# Altium project 4KW Power Factor Correction.PrjPcb
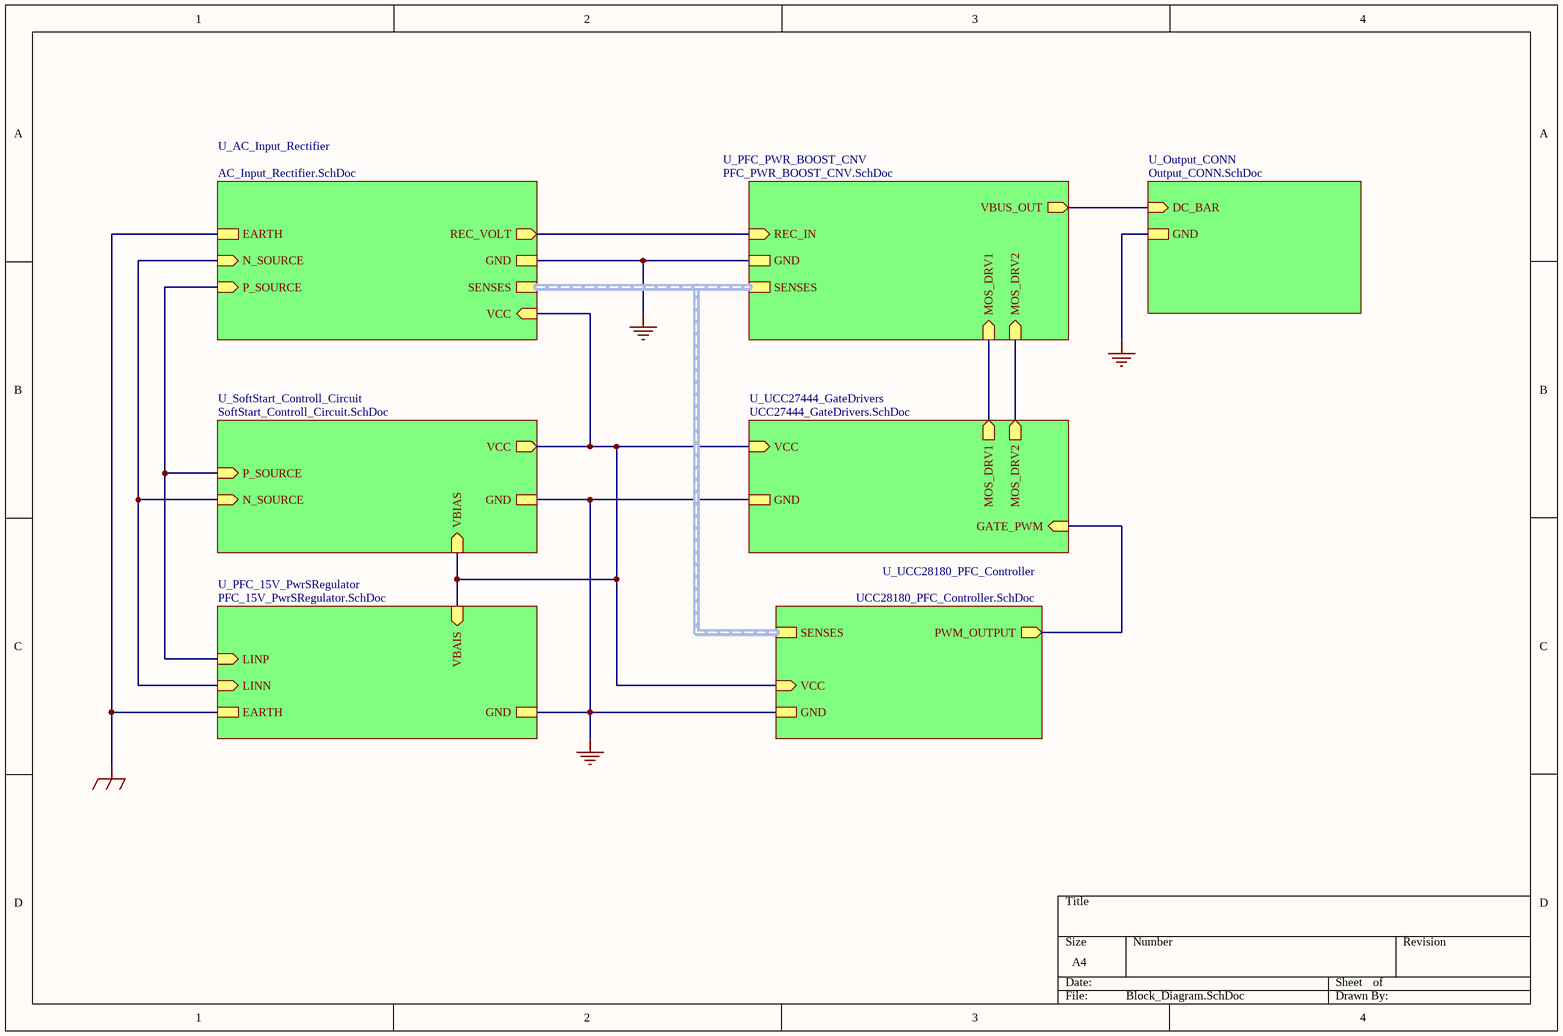
[diagram p0: Block_Diagram.SchDoc]
8 sheets, 98 parts. Net scope: hierarchical (ports join the sheet entries above them; power ports are global).
Board file: 1K5_Power_Factor_V0.PcbDoc
Sheets:
  Block_Diagram.SchDoc
    U_AC_Input_Rectifier = AC_Input_Rectifier.SchDoc
    U_PFC_PWR_BOOST_CNV = PFC_PWR_BOOST_CNV.SchDoc
    U_UCC27444_GateDrivers = UCC27444_GateDrivers.SchDoc
    U_UCC28180_PFC_Controller = UCC28180_PFC_Controller.SchDoc
    U_SoftStart_Controll_Circuit = SoftStart_Controll_Circuit.SchDoc
    U_Output_CONN = Output_CONN.SchDoc
    U_PFC_15V_PwrSRegulator = PFC_15V_PwrSRegulator.SchDoc

## Sheet Block_Diagram.SchDoc
size A4; SheetNumber: 1; SheetTotal: 8

### Sub-sheets
U_AC_Input_Rectifier = AC_Input_Rectifier.SchDoc: REC_VOLT (out), VCC (in), P_SOURCE (in), N_SOURCE (in), GND, SENSES (harness SENSES), EARTH
U_Output_CONN = Output_CONN.SchDoc: DC_BAR (in), GND
U_PFC_15V_PwrSRegulator = PFC_15V_PwrSRegulator.SchDoc: LINP (in), LINN (in), VBAIS (in), GND, EARTH
U_PFC_PWR_BOOST_CNV = PFC_PWR_BOOST_CNV.SchDoc: VBUS_OUT (out), GND, MOS_DRV1 (in), MOS_DRV2 (in), REC_IN (in), SENSES (harness SENSES)
U_SoftStart_Controll_Circuit = SoftStart_Controll_Circuit.SchDoc: GND, P_SOURCE (in), N_SOURCE (in), VBIAS (in), VCC (out)
U_UCC27444_GateDrivers = UCC27444_GateDrivers.SchDoc: MOS_DRV1 (out), MOS_DRV2 (out), VCC (in), GND, GATE_PWM (in)
U_UCC28180_PFC_Controller = UCC28180_PFC_Controller.SchDoc: VCC (in), GND, SENSES (harness SENSES), PWM_OUTPUT (out)

### Nets
15V: sheet U_AC_Input_Rectifier/VCC, sheet U_UCC27444_GateDrivers/VCC, sheet U_UCC28180_PFC_Controller/VCC, sheet U_SoftStart_Controll_Circuit/VBIAS, sheet U_SoftStart_Controll_Circuit/VCC, sheet U_PFC_15V_PwrSRegulator/VBAIS
EARTH: sheet U_AC_Input_Rectifier/EARTH, sheet U_PFC_15V_PwrSRegulator/EARTH
GND: sheet U_AC_Input_Rectifier/GND, sheet U_PFC_PWR_BOOST_CNV/GND, sheet U_UCC27444_GateDrivers/GND, sheet U_UCC28180_PFC_Controller/GND, sheet U_SoftStart_Controll_Circuit/GND, sheet U_Output_CONN/GND, sheet U_PFC_15V_PwrSRegulator/GND
VBUS: sheet U_PFC_PWR_BOOST_CNV/VBUS_OUT, sheet U_Output_CONN/DC_BAR
NetC1_2: sheet U_AC_Input_Rectifier/REC_VOLT, sheet U_PFC_PWR_BOOST_CNV/REC_IN
NetD1_2: sheet U_AC_Input_Rectifier/P_SOURCE, sheet U_SoftStart_Controll_Circuit/P_SOURCE, sheet U_PFC_15V_PwrSRegulator/LINP
NetD1_3: sheet U_AC_Input_Rectifier/N_SOURCE, sheet U_SoftStart_Controll_Circuit/N_SOURCE, sheet U_PFC_15V_PwrSRegulator/LINN
NetD6_1: sheet U_PFC_PWR_BOOST_CNV/MOS_DRV1, sheet U_UCC27444_GateDrivers/MOS_DRV1
NetR9_2: sheet U_UCC27444_GateDrivers/GATE_PWM, sheet U_UCC28180_PFC_Controller/PWM_OUTPUT
(unnamed): sheet U_PFC_PWR_BOOST_CNV/MOS_DRV2, sheet U_UCC27444_GateDrivers/MOS_DRV2

### Buses and harness runs
harness sheet U_AC_Input_Rectifier/SENSES = sheet U_PFC_PWR_BOOST_CNV/SENSES = sheet U_UCC28180_PFC_Controller/SENSES

## Sheet AC_Input_Rectifier.SchDoc
size A4; SheetNumber: 2; SheetTotal: 8
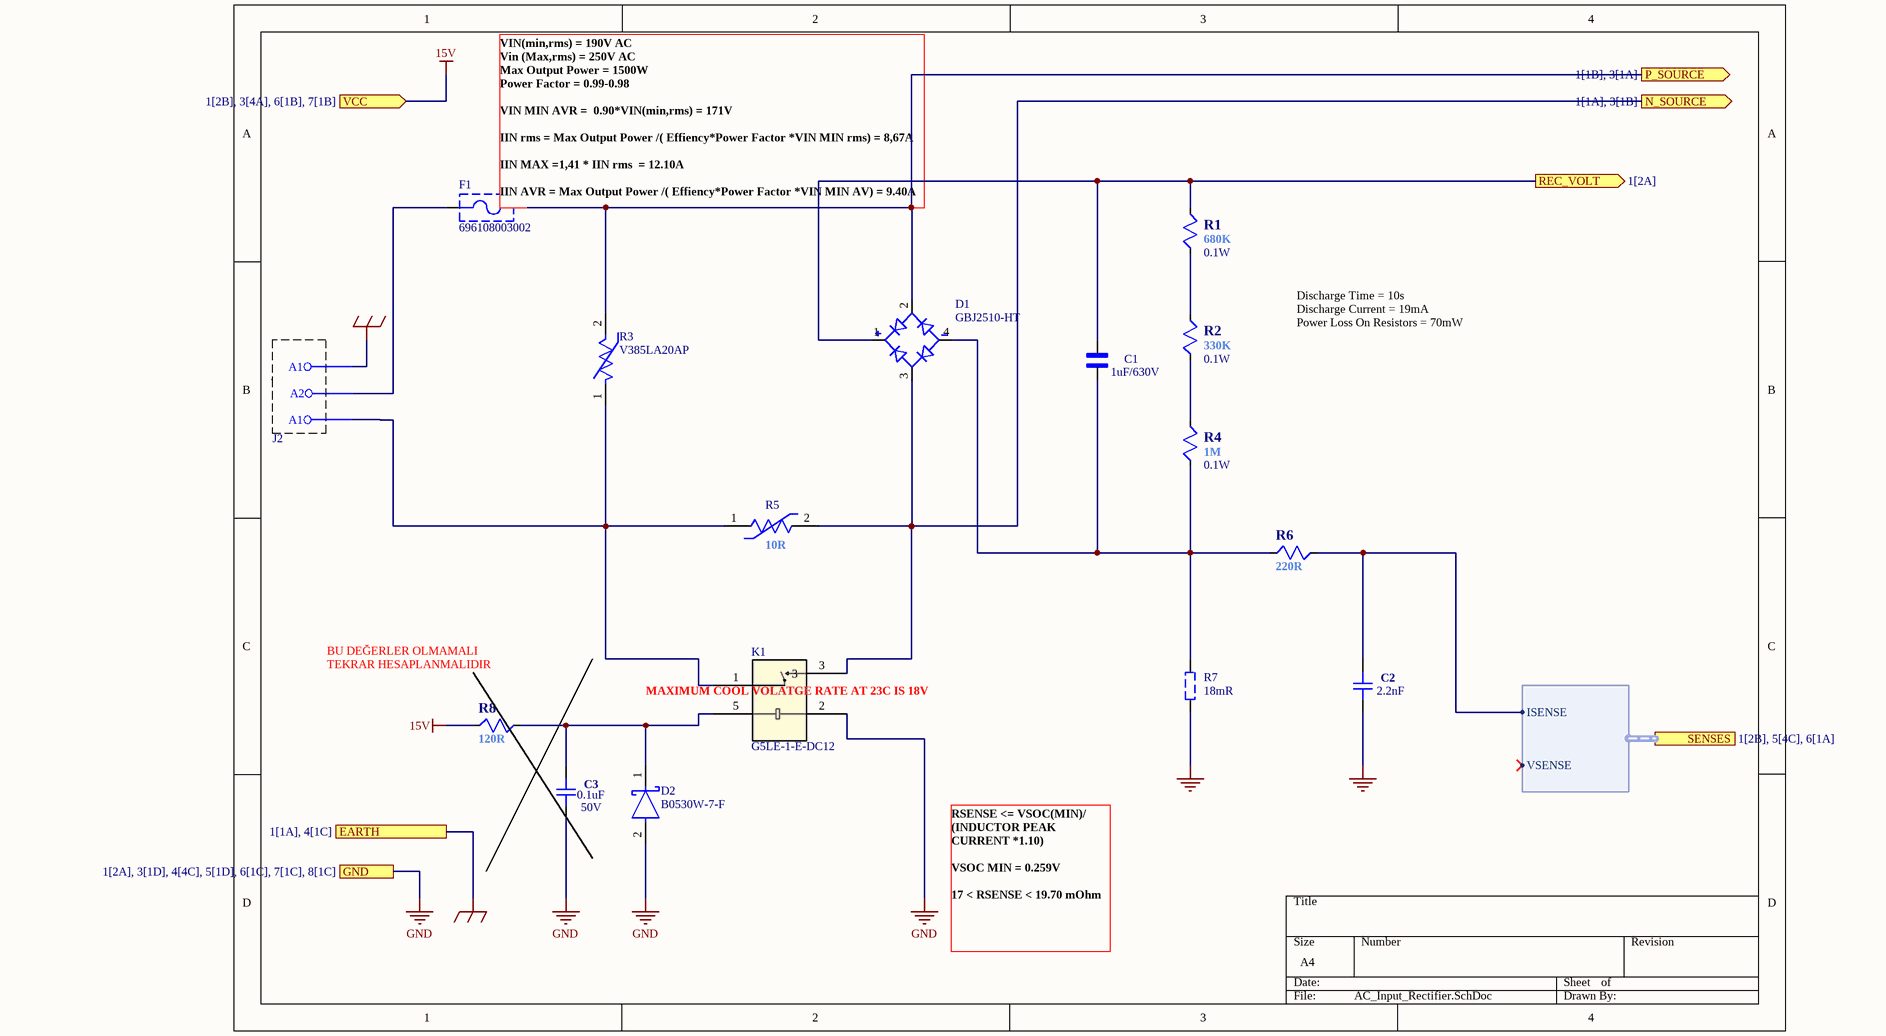
[diagram p1: AC_Input_Rectifier.SchDoc]

### Parts
C1  value 1uF/630V  [CAPRR3750W100L4150T1800H3250]  (hidden comment: B32026A3105M000)
C2  value 2.2nF  [CAPC1608N]  (hidden comment: CL10B222KB8NNNC)
C3  value 0.1uF  Rating: 50V  [CAPC1608N]  (hidden comment: CL10B104KB8NNNC)
D1  GBJ2510-HT  [DIOB_GBJ2510-F]
D2  B0530W-7-F  [FP-SOD123-MFG]
F1  696108003002  [696108003002]
J2  DG25S-B-03P-13-00AH  [DG28C-B-03P]  (value not drawn)
K1  G5LE-1-E-DC12  [G5LE-1-E-DC12]
R1  value 680K  Power Dissipation: 0.1W  [RESC1608N]  (hidden comment: CRT03F7E6803)
R2  value 330K  Power Dissipation: 0.1W  [RESC1608N]  (hidden comment: RC0603JR-07330KL)
R3  V385LA20AP  [FP-B72214S0301K101-0]
R4  value 1M  Power Dissipation: 0.1W  [RESC1608N]  (hidden comment: RI0603L105JT)
R5  Resistance: 10R  [FP-PGTL_P5_D7_4_T4_H13_4-MFG]  (hidden comment: PPL19100HA1B7CKB)
R6  value 220R  [RESC1608N]  (hidden comment: 0603SAF2200T5E)
R7  value 18mR  [CSS2H-2512]  (hidden comment: PE2512FKE7W0R018L)
R8  value 120R  [RESC1608N]  (hidden comment: CRT03J7E1200)

### Ports
EARTH (see 1[1A], 4[1C]), GND (see 1[2A], 3[1D], 4[4C], 5[1D], 6[1C], 7[1C], 8[1C]), N_SOURCE (out, see 1[1A], 3[1B]), P_SOURCE (out, see 1[1B], 3[1A]), REC_VOLT (out, see 1[2A]), SENSES (harness SENSES, see 1[2B], 5[4C], 6[1A]), VCC (in, see 1[2B], 3[4A], 6[1B], 7[1B])

### Harnesses
SENSES: ISENSE, VSENSE

### Nets
15V: R8.1 ; port VCC
EARTH: J2.3(A1) ; port EARTH
GND: C2.1 C3.1 D2.2(A) K1.2 R7.1 ; port GND
ISENSE: C2.2 R6.2 ; port SENSES.ISENSE
NetC1_1: C1.1 D1.4(NEG) R4.2 R6.1 R7.2
NetC1_2: C1.2 D1.1(POS) R1.1 ; port REC_VOLT
NetC3_2: C3.2 D2.1(C) K1.5 R8.2
NetD1_2: D1.2(AC1) F1.2 R3.2 ; port P_SOURCE
NetD1_3: D1.3(AC2) K1.3 R5.2 ; port N_SOURCE
NetF1_1: F1.1 J2.2(A2)
NetJ2_1: J2.1(A1) K1.1 R3.1 R5.1
NetR1_2: R1.2 R2.1
NetR2_2: R2.2 R4.1

### Notes on the sheet
- (near F1) VIN(min,rms) = 190V AC
  Vin (Max,rms) = 250V AC
  Max Output Power = 1500W
  Power Factor = 0.99-0.98
  VIN MIN AVR =  0.90*VIN(min,rms) = 171V
  IIN rms = Max Output Power /( Effiency*Power Factor *VIN MIN rms) = 8,67A
  IIN MAX =1,41 * IIN rms  = 12.10A
  IIN AVR = Max Output Power /( Effiency*Power Factor *VIN MIN AV) = 9.40A
- Discharge Time = 10s
  Discharge Current = 19mA
  Power Loss On Resistors = 70mW
- BU DEĞERLER OLMAMALI
- TEKRAR HESAPLANMALIDIR
- (near K1) MAXIMUM COOL VOLATGE RATE AT 23C IS 18V
- RSENSE <= VSOC(MIN)/ (INDUCTOR PEAK CURRENT *1.10)
  VSOC MIN = 0.259V
  17 < RSENSE < 19.70 mOhm

### Library data of the parts
C1 = B32026A3105M000: CAP, 1ÂµF, 20%, PP; Capacitance: 1ÂµF; Suppression Class: Y2; Product Range: B32026 Series; Voltage Rating X: -; Voltage Rating Y: 300V; Capacitor Dielectric Type: PP (Polypropylene); Capacitance Tolerance: Â± 20%; dv/dt Rating: 30; MF: TDK Electronics; SnapEDA_Link: https://www.snapeda.com/parts/B32026A3105M000/TDK/view-part/?ref=snap; Package: None; MP: B32026A3105M000; Check_prices: https://www.snapeda.com/parts/B32026A3105M000/TDK/view-part/?ref=eda
C2 = CAP_0805: MLCC (1608) 0603 2.2nF 50VDC ±10% X7R; Rating: 50V; Manufacturer: *; Manufacturer Part Number: *; Distributor Link: *; LCSC: *
C3 = CAP_0805: MLCC (1608) 0603 100nF 50VDC ±10% X7R; Manufacturer: *; Manufacturer Part Number: *; Distributor Link: *; LCSC: *
D1 = GBJ2510-HT: DIODE BRIDGE 25A 1000V; MF: Micro Commercial; MP: GBJ3510-BP; SnapEDA_Link: https://www.snapeda.com/parts/GBJ3510-BP/Micro%20Commercial/view-part/52240/?ref=snap; Availability: Warning; Purchase-URL: https://pricing.snapeda.com/search/part/GBJ3510-BP/?ref=eda; Check_prices: https://www.snapeda.com/parts/GBJ3510-BP/Micro%20Commercial/view-part/52240/?ref=eda; Value: *; Package: SIP-4 Micro Commercial; Price: None
D2 = CMP-2000-05879-2: DIODE SCHOTTKY 30V 500MA SOD123; Manufacturer: Diodes Inc.; Max Surge Forward Current: 5.5A; Forward Current: 0.5A; Max Junction Temp: +125°C; Standoff Height: 0mm; Capacitance: 170pF; Value: 170pF; Peak Reverse Current: 130uA; Footprint Url: https://www.diodes.com/assets/Package-Files/SOD123.pdf; Device Class L1: Discrete Semiconductors; ComponentLink2Description: Datasheet; Mouser Description: Schottky Diodes & Rectifiers 30V 410mW; Device Class L3: Schottky Diodes; Package: SOD123; Temperature: -65°C to +125°C; Temperature Range Low: -65°C; Lead Free: Yes; Digikey Description: DIODE SCHOTTKY 30V 500MA SOD123; Ipc Land Pattern Name: SOD365155X123-2; Automotive: No; Octopart: https://octopart.com/b0530w-7-f-diodes+inc.-325721; Device Class L2: Diodes; ComponentLink2URL: https://www.diodes.com/assets/Datasheets/ds30139.pdf; RoHS: TRUE; Height: 1.45mm; Max Repetitive Reverse Voltage: 30V; Category: Diode; Temperature Range High: +125°C; Manufacturer Part Number: B0530W-7-F; Reverse Voltage: 30V
F1 = CMP-1502-00237-2: FUSE HOLDER 5x20 TK79 PLASTIC; NexarPartId: 56808807; Voltage Rating (AC): 250V; Fuse Current: 10A; REACH SVHC: Unknown; RoHS: Non-Compliant; Mount: Through Hole; Packaging: Box
J2 = DG25S-B-03P-13-00AH: TERM.BLK.7.62MM 3P BARRIER TERMINAL BLACK
K1 = G5LE-1-E-DC12: RELAY POWER 16A 12V 1FormC 5PIN; Manufacturer_Name: Omron; Copyright: Copyright (C) 2025 Ultra Librarian. All rights reserved.; Manufacturer_Part_Number: G5LE-1-E-DC12; RefDes: RefDes; Type: Type
R1 = RES: RES.(1608) 0603 680K Ohms 1% 1/10W 100PPM,
R2 = RES: RES.(1608) 0603 330K Ohms 5% 1/10W 100PPM SMT,
R3 = CMP-10618-000016-1: VARISTOR 470V 4.5KA DISC 14MM; Energy: 76J; Clamping Voltage: 775V; Voltage Rating (AC): 300V; Lead Length: 30mm; Capacitance: 300pF; Lead/Base Style: Radial; Tolerance: 10%; Clamping Current: 50A; Max Voltage Rating (DC): 385V; Packaging: Bulk; Min Operating Temperature: -40°C; Max Operating Temperature: 85°C; Depth: 5.2mm; Lead Pitch: 7.5mm; Max Surge Current: 4.5kA; Package Quantity: 500; RoHS Compliant: Yes; Max Voltage Rating (AC): 300V; Mount: Radial; Varistor Voltage: 470V; REACH SVHC: No SVHC; Thickness: 5.2mm; Series: StandardD; Diameter: 14mm; Weight: 0.141096oz; Voltage Tolerance: 10%; Voltage Rating (DC): 385V
R4 = RES: RES.(1608) 0603 1M Ohms 5% 1/10W 200PPM,
R5 = CMP-06022-000524-1: THERMISTOR PTC 10R 270VAC
R6 = RES: RES.(1608) 0603 220 Ohms 1% 1/10W-S 100PPM
R7 = CSS2H-2512: 18 mOhms ±1% 2W Chip Resistor 2512 (6332 Metric) Automotive AEC-Q200, Current Sense Metal Film; Manufacturer: YAGEO; Manufacturer Part Number: PE2512FKE7W0R018L
R8 = RES: RES.(1608) 0603 120 Ohms 5% 1/10W-S 100PPM

## Sheet PFC_PWR_BOOST_CNV.SchDoc
size A4; SheetNumber: 5; SheetTotal: 8
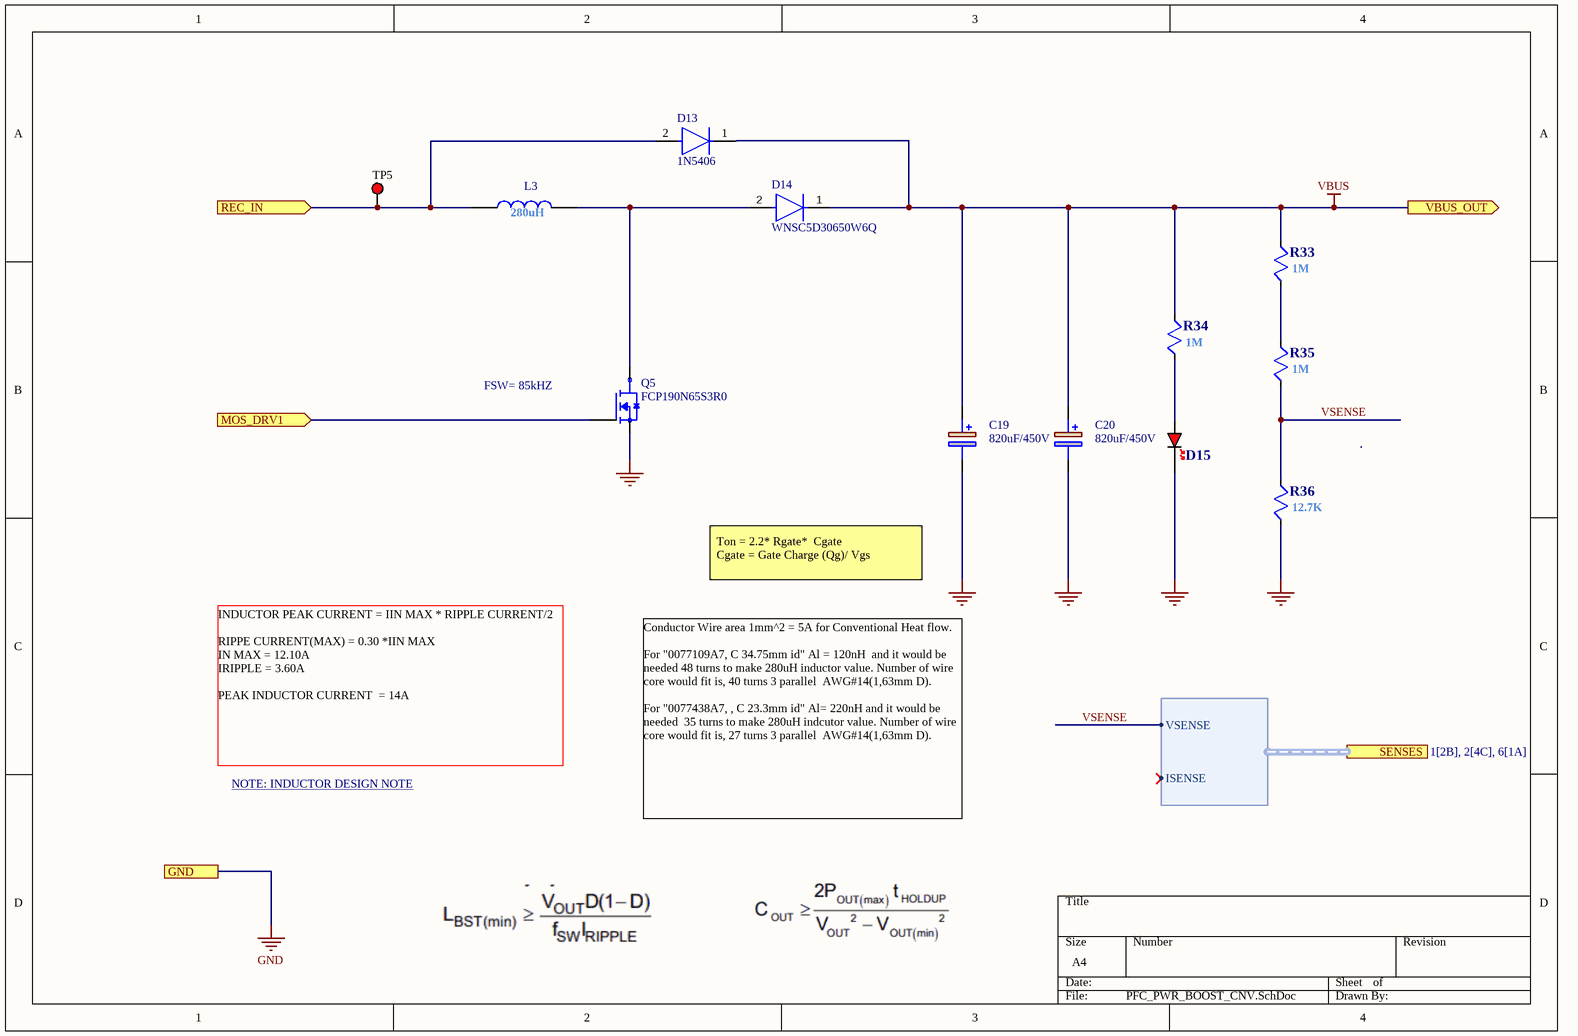
[diagram p2: PFC_PWR_BOOST_CNV.SchDoc]

### Parts
C19  value 820uF/450V  [CAPPRD1000W180D3550H5250]  (hidden comment: ESMR451VSN821MA50S)
C20  value 820uF/450V  [CAPPRD1000W180D3550H5250]  (hidden comment: ESMR451VSN821MA50S)
D13  1N5406  [FP-1N5406-E3-54-MFG]
D14  WNSC5D30650W6Q  [WNSC5D30650W6Q]
D15  19-21/R6C-AP1Q2/4T  [LED_0603_RED]  (value not drawn)
L3  value 280uH  [0077438A7]  (hidden comment: 0077438A7)
Q5  FCP190N65S3R0  [Mosfet_T0220]
R33  value 1M  [RESC1608N]  (hidden comment: 0603SAJ0105TDE)
R34  value 1M  [RESC1608N]  (hidden comment: 0603SAJ0105TDE)
R35  value 1M  [RESC1608N]  (hidden comment: 0603SAJ0105TDE)
R36  value 12.7K  [RESC1608N]  (hidden comment: CR-03FA7--12K7)
TP5  5010  [KSTN-5010_V]  (value not drawn)

### Ports
GND (see 1[2A], 2[1D], 3[1D], 4[4C], 6[1C], 7[1C], 8[1C]), MOS_DRV1 (in, see 1[3B], 7[4B]), REC_IN (in, see 1[2A]), SENSES (harness SENSES, see 1[2B], 2[4C], 6[1A]), VBUS_OUT (out, see 1[3A])

### Harnesses
SENSES: ISENSE, VSENSE

### Nets
GND: C19.2(-) C20.2(-) D15.K Q5.3(S) R36.2 ; port GND
VBUS: C19.1(+) C20.1(+) D13.1(C) D14.1(K) R33.1 R34.1 ; port VBUS_OUT
VSENSE: R35.2 R36.1 ; port SENSES.VSENSE
NetC1_2: D13.2(A) L3.1 TP5.1 ; port REC_IN
NetD6_1: Q5.1(G) ; port MOS_DRV1
NetD14_2: D14.2(A) L3.2 Q5.2(D)
NetD15_A: D15.A R34.2
NetR33_2: R33.2 R35.1

### Notes on the sheet
- FSW= 85kHZ
- Ton = 2.2* Rgate*  Cgate
  Cgate = Gate Charge (Qg)/ Vgs
- INDUCTOR PEAK CURRENT = IIN MAX * RIPPLE CURRENT/2
  RIPPE CURRENT(MAX) = 0.30 *IIN MAX
  IN MAX = 12.10A
  IRIPPLE = 3.60A
  PEAK INDUCTOR CURRENT  = 14A
- NOTE: INDUCTOR DESIGN NOTE <https://www.micrometals.com/design-and-applications/design-tools/inductor-designer/>
- Conductor Wire area 1mm^2 = 5A for Conventional Heat flow.
  For "0077109A7, C 34.75mm id" Al = 120nH  and it would be needed 48 turns to make 280uH inductor value. Number of wire core would fit is, 40 turns 3 parallel  AWG#14(1,63mm D).
  For "0077438A7, , C 23.3mm id" Al= 220nH and it would be needed  35 turns to make 280uH indcutor value. Number of wire core would fit is, 27 turns 3 parallel  AWG#14(1,63mm D).

### Library data of the parts
C19 C20 = ESMR451VSN821MA50S: Aluminum Electrolytic Capacitors - Snap In 450V 820uF 20% Tol.; Manufacturer_Name: Chemi-Con; Geometry.Height: 52.5mm; Mouser Part Number: 661-ESMR451N821MA50S; Mouser Price/Stock: https://www.mouser.co.uk/ProductDetail/United-Chemi-Con/ESMR451VSN821MA50S/?qs=Odivq8ja527O2dyonXL23g%3D%3D; Manufacturer_Part_Number: ESMR451VSN821MA50S; Datasheet Link: https://www.chemi-con.co.jp/products/relatedfiles/capacitor/catalog/SMRN-e.PDF
D13 = CMP-02540-000085-1: DIODE GEN PURP 600V 3A DO201AD
D14 = WNSC5D30650W6Q: DIODE SIL.CARB.SCHOTTKY 30A 650V TO247F-2L THT
D15 = LED_0603_RED: LED SMD 0603 RED 28.5-72mcd 100° WATER CLEAR
L3 = 0077438A7: Coated Kool Mu Ferrite Core Toroid Type Length Width 1.875" (47.63mm) Diameter 0.745" (18.92mm) Height
Q5 = Mosfet_TO220: MOSFET DIS.17A 650V N-CH TO220-3; RS Part Number: *; RS Stock/Price: *; Manufacturer_Name: *; Manufacturer_Part_Number: *; Datasheet Link: *
R33-R35 = RES: RES.(1608) 0603 1M Ohms 5% 1/10W-S 100PPM
R36 = RES: RES.(1608) 0603 12.7K Ohms 1% 1/4W 100PPM
TP5 = CMP-1672-00002-4: Test Point, Red, Through Hole, RoHS, Bulk; Manufacturer: Keystone; Contact Material: Bronze; Mounting Technology: Through Hole; RoHSCompliant: true; Pins: 1; Package Quantity: 100; ComponentLink2Description: Datasheet; Height: 8.12 mm; ComponentLink1URL: http://www.keyelco.com/; DatasheetVersion: Rev. F, 12/2013; Mount: Through Hole; PackageReference: 5010; Contact Plating: Silver; Packaging: Bulk; Colour: Red; REACH SVHC: No SVHC; PackageDescription: 1-Pin Through Hole Device, Dia 3.17 mm; ComponentLink2URL: http://www.keyelco.com/product-pdf.cfm?p=1319; ComponentLink1Description: Manufacturer URL

## Sheet UCC27444_GateDrivers.SchDoc
size A4; SheetNumber: 7; SheetTotal: 8
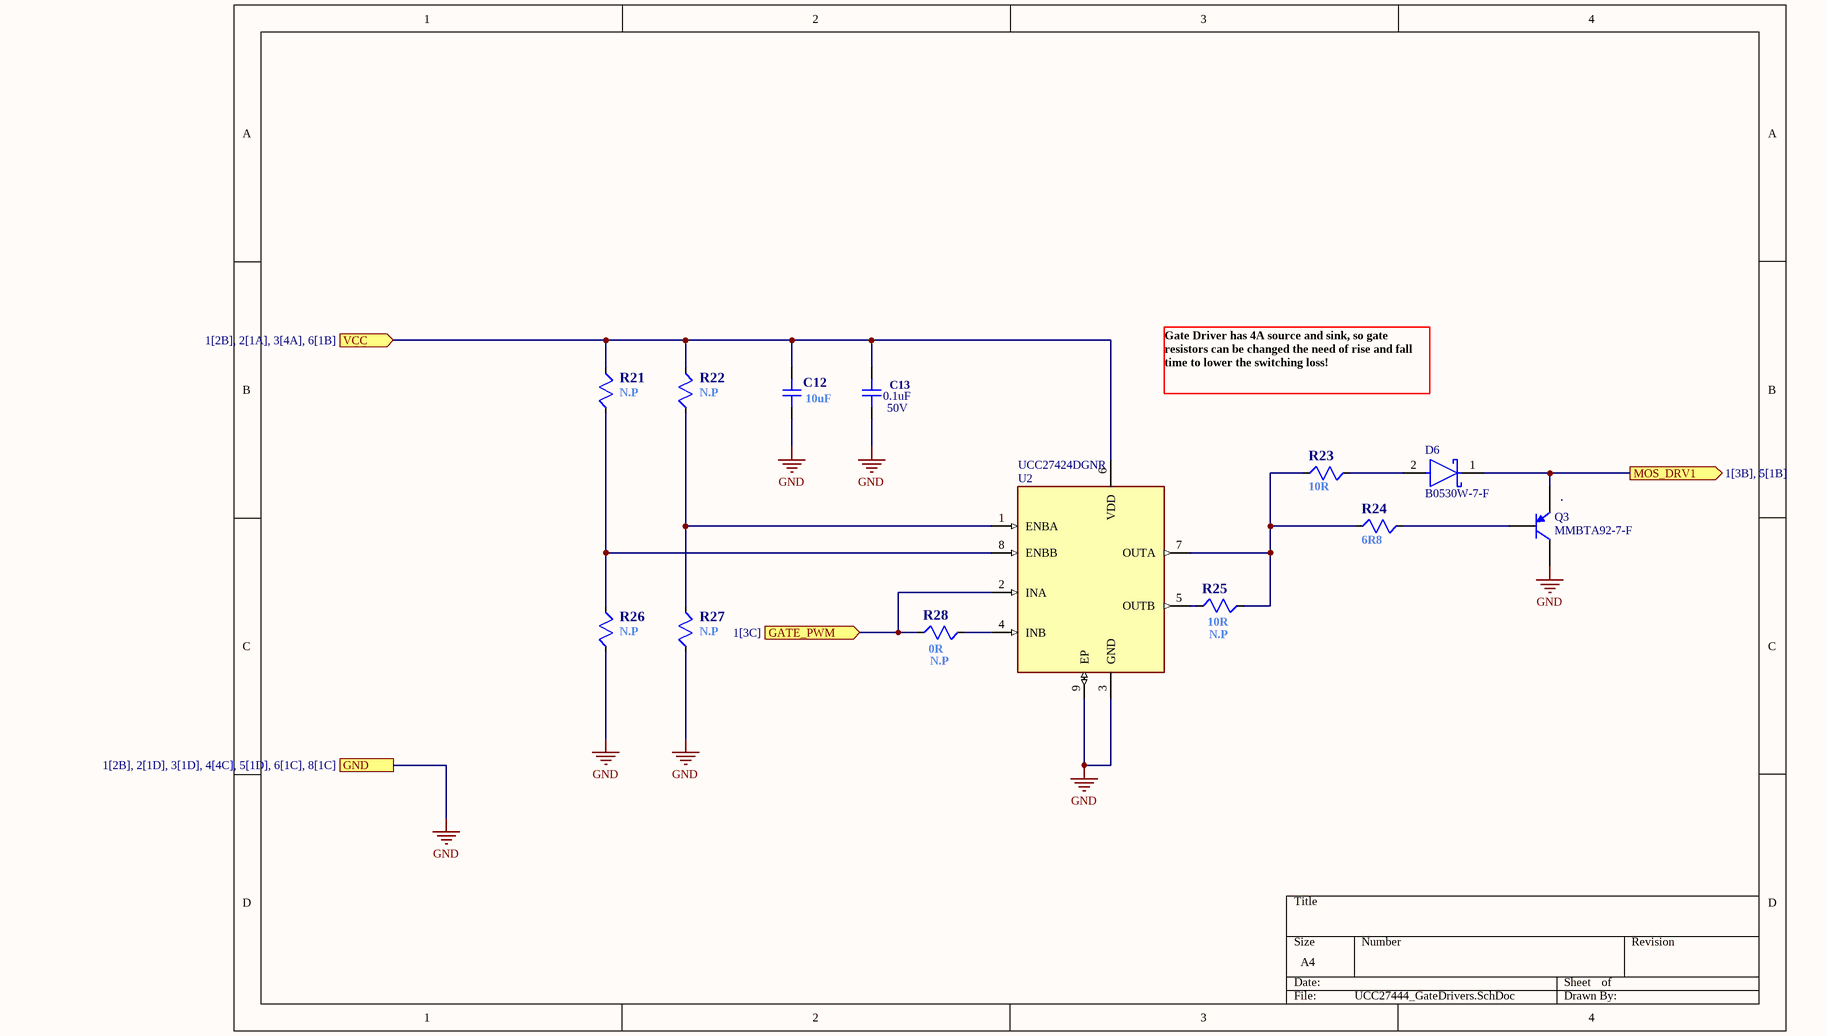
[diagram p3: UCC27444_GateDrivers.SchDoc]

### Parts
C12  value 10uF  [CAP_0805]  (hidden comment: CL21A106KAYNNNE)
C13  value 0.1uF  Rating: 50V  [CAPC1608N]  (hidden comment: CL10B104KB8NNNC)
D6  B0530W-7-F  [FP-SOD123-MFG]
Q3  MMBTA92-7-F  [DIOD-SOT23-3_V]
R21  N.P  [RESC1608N]
R22  N.P  [RESC1608N]
R23  value 10R  [RESC1608N]  (hidden comment: 0603SAJ0100T5E)
R24  value 6R8  [RESC1608N]  (hidden comment: 0603SAJ068JT5E)
R25  N.P  value 10R  [RESC1608N]
R26  N.P  [RESC1608N]
R27  N.P  [RESC1608N]
R28  N.P  value 0R  [RESC1608N]
U2  UCC27424DGNR  [SOP65P490X110-9N]

### Ports
GATE_PWM (in, see 1[3C]), GND (see 1[2B], 2[1D], 3[1D], 4[4C], 5[1D], 6[1C], 8[1C]), MOS_DRV1 (out, see 1[3B], 5[1B]), VCC (in, see 1[2B], 2[1A], 3[4A], 6[1B])

### Nets
15V: C12.2 C13.2 R21.1 R22.1 U2.6(VDD) ; port VCC
GND: C12.1 C13.1 Q3.3(C) R26.2 R27.2 U2.3(GND) U2.9(EP) ; port GND
NetD6_1: D6.1(C) Q3.2(E) ; port MOS_DRV1
NetD6_2: D6.2(A) R23.1
NetQ3_1: Q3.1(B) R24.1
NetR9_2: R28.2 U2.2(INA) ; port GATE_PWM
NetR21_2: R21.2 R26.1 U2.8(ENBB)
NetR22_2: R22.2 R27.1 U2.1(ENBA)
NetR23_2: R23.2 R24.2 R25.1 U2.7(OUTA)
NetR25_2: R25.2 U2.5(OUTB)
NetR28_1: R28.1 U2.4(INB)

### Notes on the sheet
- Gate Driver has 4A source and sink, so gate resistors can be changed the need of rise and fall time to lower the switching loss!

### Library data of the parts
C12 = CAP_0805: MLCC (2012) 0805 10uF 25VDC ±10% X5R; Manufacturer: YAGEO; Manufacturer Part Number: CC0805KKX7R9BB105; Rating: 50V; Distributor Link: https://www.digikey.com/en/products/detail/yageo/CC0805KKX7R9BB105/5195292; LCSC: X7R; Dielectric: *
C13 = CAP_0805: MLCC (1608) 0603 100nF 50VDC ±10% X7R; Manufacturer: *; Manufacturer Part Number: *; Distributor Link: *; LCSC: *
D6 = CMP-2000-05879-2: as D2 on sheet AC_Input_Rectifier; Footprint Url: https://www.diodes.com/assets/Package-Files/SOD123.pdf; Device Class L1: Discrete Semiconductors; ComponentLink2Description: Datasheet; Mouser Description: Schottky Diodes & Rectifiers 30V 410mW; Device Class L3: Schottky Diodes; Package: SOD123; Temperature: -65°C to +125°C; Temperature Range Low: -65°C; Lead Free: Yes; Digikey Description: DIODE SCHOTTKY 30V 500MA SOD123; Ipc Land Pattern Name: SOD365155X123-2; Automotive: No; Octopart: https://octopart.com/b0530w-7-f-diodes+inc.-325721; Device Class L2: Diodes; ComponentLink2URL: https://www.diodes.com/assets/Datasheets/ds30139.pdf; RoHS: TRUE; Height: 1.45mm; Max Repetitive Reverse Voltage: 30V; Category: Diode; Temperature Range High: +125°C; Manufacturer Part Number: B0530W-7-F; Reverse Voltage: 30V
Q3 = CMP-2000-06736-1: PNP Small Signal Transisitor, 500 mA, 300 mW, -55 to 150 degC, 3-Pin SOT23, RoHS, Tape and Reel; DC Collector/Base Gain hfe Min: 40; Brand: DiodesIncorporated; Maximum DC Collector Current: 0.5A; Collector- Base Voltage VCBO: -300V; Pd - Power Dissipation: 300mW; Unit Weight: 0.000282oz; Configuration: Single; Emitter- Base Voltage VEBO: -5V; Continuous Collector Current: -0.2A; Gain Bandwidth Product fT: 50MHz; Collector-Emitter Saturation Voltage: -0.5V; Minimum Operating Temperature: -55C; Transistor Polarity: PNP; Manufacturer URL: http://www.diodes.com/; Mounting Style: SMD/SMT; Height: 1mm; Product Category: BipolarTransistors-BJT; Package / Case: SOT-23; Package Description: 3-Pin Small Outline Transistor, Body 2.9 x 1.3 mm, Pitch 0.96 mm; Mounting Technology: SurfaceMount; Manufacturer: DiodesIncorporated; Collector- Emitter Voltage VCEO Max: -300V; Series: MMBTA92; Maximum Operating Temperature: +150C; Length: 3.05mm; Width: 1.4mm; Factory Pack Quantity: 3000; Datasheet URL: http://www.diodes.com/_files/datasheets/ds30060.pdf; Package Reference: SOT23-3; Packaging: Reel; RoHS: True; Datasheet Version: Rev. 12-2, 05/2015
R21 R22 R26 R27 = RES: 0.1W, 1/10W Chip Resistor 0603 (1608 Metric); Value: N.P
R23 R25 R28 = RES: RES.(1608) 0603 10 Ohms 5% 1/10W-S 400PPM
R24 = RES: RES.(1608) 0603 6.8 Ohms 5% 1/10W-S 400PPM
U2 = UCC27424DGNR: Dual Low-Side Gate Driver IC Non-Inverting 8-HVSSOP; MF: {'manufacturer': u'Texas Instruments'}; Package: None; Price: None; Value: *; MP: UCC27424DGNR; Availability: Unavailable

## Sheet UCC28180_PFC_Controller.SchDoc
size A4; SheetNumber: 6; SheetTotal: 8
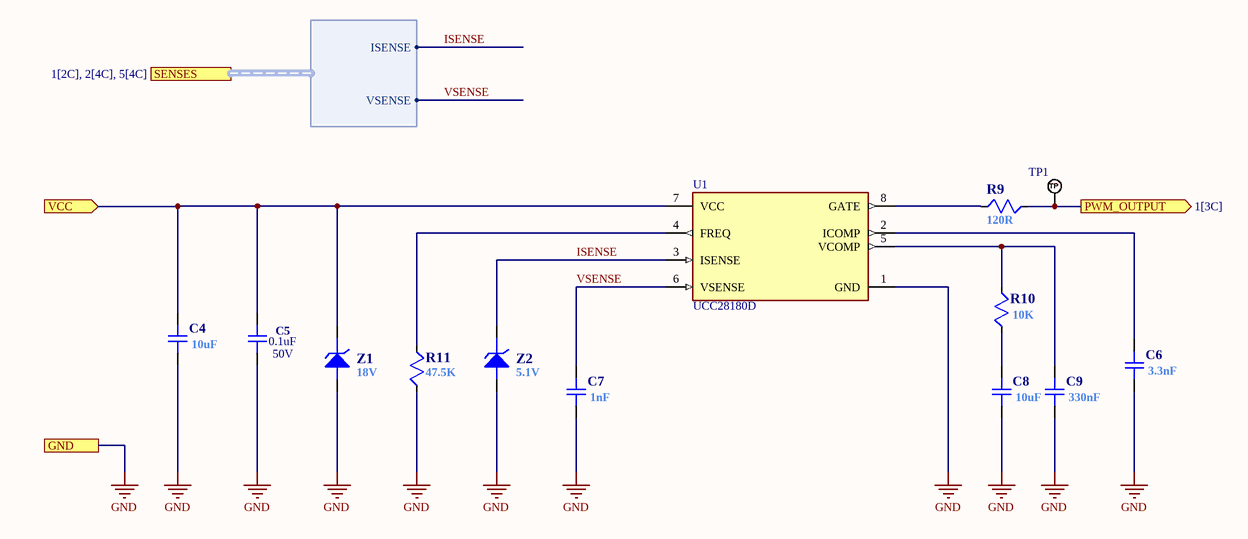
[diagram p4: UCC28180_PFC_Controller.SchDoc]

### Parts
C4  value 10uF  [CAP_0805]  (hidden comment: CL21A106KAYNNNE)
C5  value 0.1uF  Rating: 50V  [CAPC1608N]  (hidden comment: CL10B104KB8NNNC)
C6  value 3.3nF  [CAP_0805]  (hidden comment: CL10B332KB8NNNC)
C7  value 1nF  [CAP_0805]  (hidden comment: CL10B102KB8NNNC)
C8  value 10uF  [CAP_0805]  (hidden comment: CL21A106KAYNNNE)
C9  value 330nF  [CAP_0805]  (hidden comment: CL10F334ZA8NNNC)
R9  value 120R  [RESC1608N]  (hidden comment: CRT03J7E1200)
R10  value 10K  [RESC1608N]  (hidden comment: RC0603JR-0710KL)
R11  value 47.5K  [RESC1608N]  (hidden comment: 0603SAF4752T5E)
TP1  TP_NOBOM  [PAD_RND_1MM]  (value not drawn)  (no BOM)
U1  UCC28180D  [FP-D0008A-MFG]
Z1  value 18V  [SOD523C]  (hidden comment: MMSZ18V-HT)
Z2  value 5.1V  [SOD523C]  (hidden comment: BZT52C5V1TQ-7-F)

### Ports
GND (see 1[2C], 2[1D], 3[1D], 4[4C], 5[1D], 7[1C], 8[1C]), PWM_OUTPUT (out, see 1[3C]), SENSES (harness SENSES, see 1[2C], 2[4C], 5[4C]), VCC (in, see 1[2C], 2[1A], 3[4A], 7[1B])

### Harnesses
SENSES: ISENSE, VSENSE

### Nets
15V: C4.2 C5.2 U1.7(VCC) Z1.2(K) ; port VCC
GND: C4.1 C5.1 C6.1 C7.1 C8.1 C9.1 R11.1 U1.1(GND) Z1.1(A) Z2.1(A) ; port GND
ISENSE: U1.3(ISENSE) Z2.2(K) ; port SENSES.ISENSE
VSENSE: C7.2 U1.6(VSENSE) ; port SENSES.VSENSE
NetC6_2: C6.2 U1.2(ICOMP)
NetC8_2: C8.2 R10.2
NetC9_2: C9.2 R10.1 U1.5(VCOMP)
NetR9_1: R9.1 U1.8(GATE)
NetR9_2: R9.2 TP1.1(TP) ; port PWM_OUTPUT
NetR11_2: R11.2 U1.4(FREQ)

### Library data of the parts
C4 C8 = CAP_0805: as C12 on sheet UCC27444_GateDrivers; Distributor Link: https://www.digikey.com/en/products/detail/yageo/CC0805KKX7R9BB105/5195292; LCSC: X7R; Dielectric: *
C5 = CAP_0805: MLCC (1608) 0603 100nF 50VDC ±10% X7R; Manufacturer: *; Manufacturer Part Number: *; Distributor Link: *; LCSC: *
C6 = CAP_0805: MLCC (1608) 0603 3.3nF 50VDC ±10% X7R; Manufacturer: YAGEO; Manufacturer Part Number: CC0805KKX7R9BB105; Rating: 50V; Distributor Link: https://www.digikey.com/en/products/detail/yageo/CC0805KKX7R9BB105/5195292; LCSC: X7R; Dielectric: *
C7 = CAP_0805: MLCC (1608) 0603 1nF 50VDC ±10% X7R; Manufacturer: YAGEO; Manufacturer Part Number: CC0805KKX7R9BB105; Rating: 50V; Distributor Link: https://www.digikey.com/en/products/detail/yageo/CC0805KKX7R9BB105/5195292; LCSC: X7R; Dielectric: *
C9 = CAP_0805: MLCC (1608) 0603 330nF 25VDC -20% +80% Y5V; Manufacturer: YAGEO; Manufacturer Part Number: CC0805KKX7R9BB105; Rating: 50V; Distributor Link: https://www.digikey.com/en/products/detail/yageo/CC0805KKX7R9BB105/5195292; LCSC: X7R; Dielectric: *
R9 = RES: as R8 on sheet AC_Input_Rectifier
R10 = RES: RES.(1608) 0603 10K Ohms 5% 1/10W 100PPM SMT
R11 = RES: RES.(1608) 0603 47.5K Ohms 1% 1/10W-S 100PPM
TP1 = TEST_POINT_RND_1MM: Test Point Round 1mm (NO BOM)
U1 = CMP-04918-000038-1: IC PFC CTRLR AVERAGE CURR 8SOIC; Manufacturer: Texas Instruments; Max Supply Voltage: 21V; Output Type: Fixed; Max Duty Cycle: 98%; Number Of Outputs: 1; Output Voltage: 390mV; Standoff Height: 0.11mm; Output Current: 40uA; Nominal Supply Current: 7mA; Switching Frequency: 65kHz; Max Junction Temp: +125°C; Switching Topology: Buck; Lead Free: Yes; Height: 1.75mm; Automotive: No; Category: IC; Device Class L1: Integrated Circuits (ICs); Octopart: https://octopart.com/ucc28180d-texas+instruments-31566950; Mouser Description: Power Factor Correction - PFC 8-PIN CCM PFC CONTROLLER; Ipc Land Pattern Name: SOIC127P600X175-8; RoHS: TRUE; Temperature: -40°C to +125°C; Package: D0008A; Temperature Range High: +125°C; Device Class L3: Voltage Regulators - Switching; ComponentLink2Description: Datasheet; Device Class L2: Power Management ICs; Manufacturer Part Number: UCC28180D; Temperature Range Low: -40°C; Digikey Description: IC PFC CTRLR AVERAGE CURR 8SOIC; ComponentLink2URL: http://www.ti.com/lit/ds/symlink/ucc28180.pdf
Z1 = ZENER-1: DIODE ZENER 500mW 18V ±5% SOD123 SMT
Z2 = ZENER-1: Zener Diode 5.1 V 300 mW ±6% Surface Mount SOD-523

## Sheet SoftStart_Controll_Circuit.SchDoc
size A4; SheetNumber: 3; SheetTotal: 8
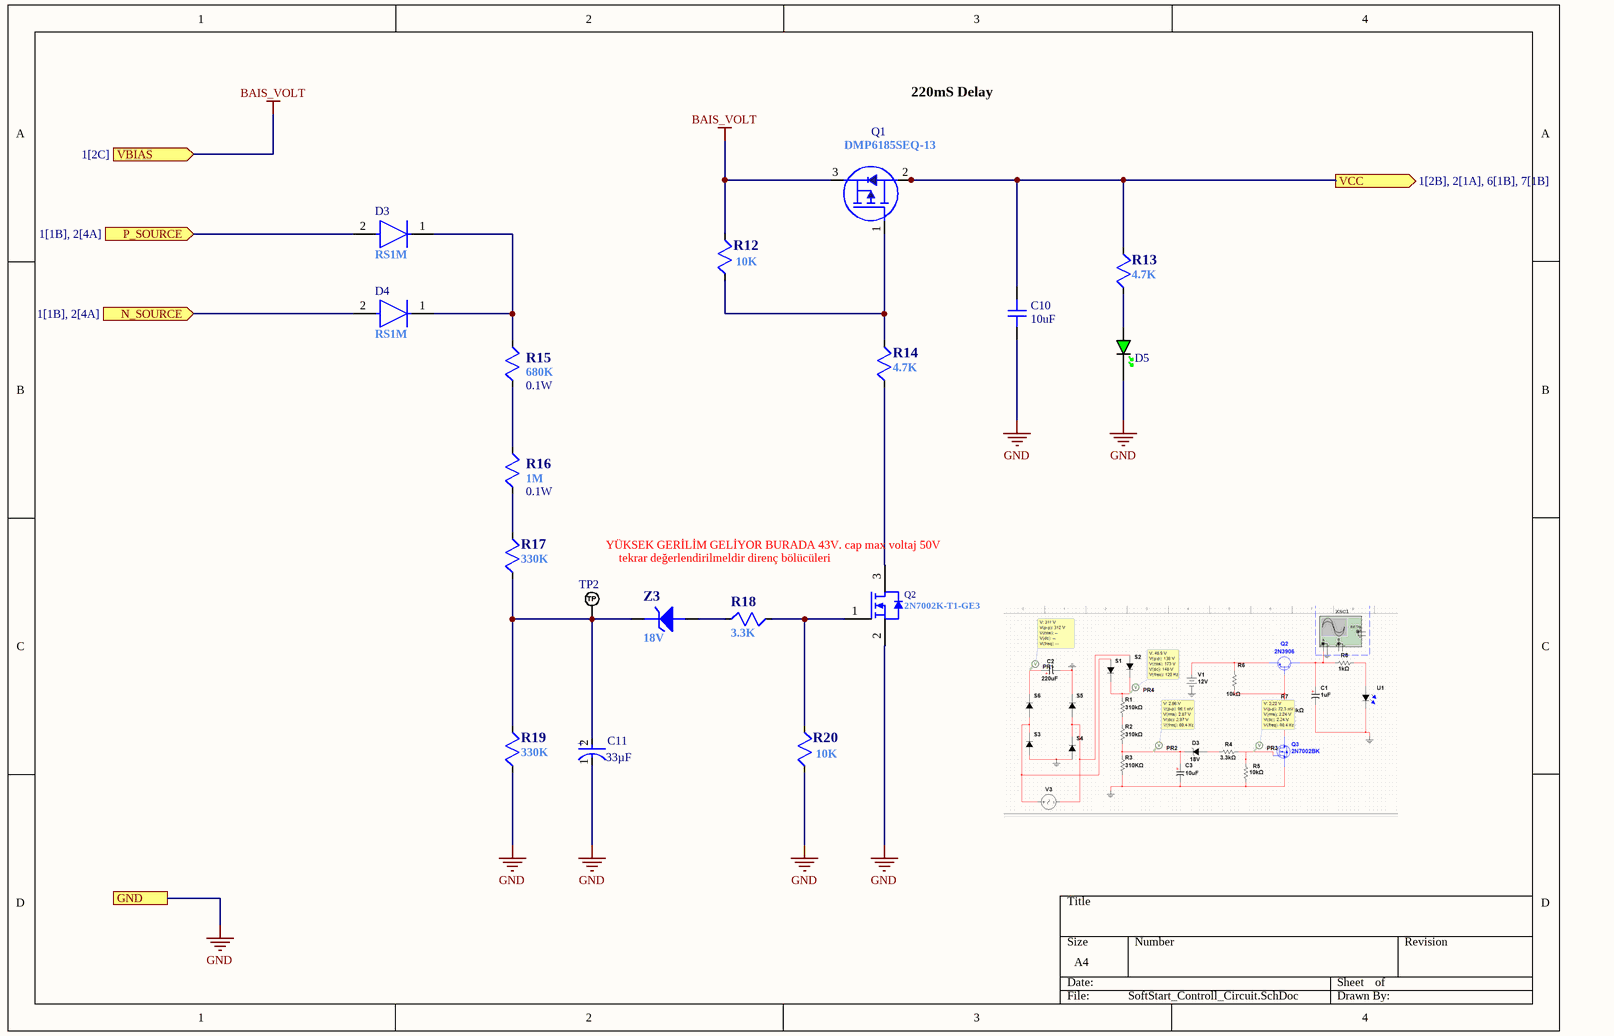
[diagram p5: SoftStart_Controll_Circuit.SchDoc]

### Parts
C10  value 10uF  [CAP_0805]  (hidden comment: CL21A106KAYNNNE)
C11  value 33µF  [FP-FKE-MFG]  (hidden comment: BXJ50VC33MF80TP)
D3  RS1M  [FP-403AE-MFG]
D4  RS1M  [FP-403AE-MFG]
D5  LTST-C190TGKT  [LED_0603_GREEN]  (value not drawn)
Q1  DMP6185SEQ-13  [SOT223]
Q2  2N7002K-T1-GE3  [SOT23-3]
R12  value 10K  [RESC1608N]  (hidden comment: RC0603JR-0710KL)
R13  value 4.7K  [RESC1608N]  (hidden comment: 0603SAF4701T5E)
R14  value 4.7K  [RESC1608N]  (hidden comment: 0603SAF4701T5E)
R15  value 680K  Power Dissipation: 0.1W  [RESC1608N]  (hidden comment: CRT03F7E6803)
R16  value 1M  Power Dissipation: 0.1W  [RESC1608N]  (hidden comment: RI0603L105JT)
R17  value 330K  [RESC1608N]  (hidden comment: RC0603JR-07330KL)
R18  value 3.3K  [RESC1608N]  (hidden comment: CQ03SAF3301T5E)
R19  value 330K  [RESC1608N]  (hidden comment: RC0603JR-07330KL)
R20  value 10K  [RESC1608N]  (hidden comment: RC0603JR-0710KL)
TP2  TP_NOBOM  [PAD_RND_1MM]  (value not drawn)  (no BOM)
Z3  value 18V  [SOD523C]  (hidden comment: MMSZ18V-HT)

### Ports
GND (see 1[2B], 2[1D], 4[4C], 5[1D], 6[1C], 7[1C], 8[1C]), N_SOURCE (in, see 1[1B], 2[4A]), P_SOURCE (in, see 1[1B], 2[4A]), VBIAS (in, see 1[2C]), VCC (out, see 1[2B], 2[1A], 6[1B], 7[1B])

### Nets
BAIS_VOLT: C10.1 Q1.2(D) Q1.3(S) Q1.4(D) R12.1 R13.1 ; port VBIAS, port VCC  [project net 15V]
GND: C10.2 C11.1(C) D5.K Q2.2 R19.2 R20.2 ; port GND
NetC11_2: C11.2(A) R17.1 R19.1 TP2.1(TP) Z3.2(K)
NetD1_2: D3.2(A) ; port P_SOURCE
NetD1_3: D4.2(A) ; port N_SOURCE
NetD3_1: D3.1(C) D4.1(C) R15.1
NetD5_A: D5.A R13.2
NetQ1_1: Q1.1(G) R12.2 R14.1
NetQ2_1: Q2.1 R18.2 R20.1
NetQ2_3: Q2.3 R14.2
NetR15_2: R15.2 R16.1
NetR16_2: R16.2 R17.2
NetR18_1: R18.1 Z3.1(A)

### Notes on the sheet
- 220mS Delay
- YÜKSEK GERİLİM GELİYOR BURADA 43V. cap max voltaj 50V
- (near Q2) tekrar değerlendirilmeldir direnç bölücüleri
- (in symbol CMP-00287-05444366-1) +

### Library data of the parts
C10 = CAP_0805: MLCC (2012) 0805 10uF 25VDC ±10% X5R
C11 = CMP-00287-05444366-1: Aluminum Electrolytic Capacitor, 33 uF, 50 V, ± 20%, 2000 hours @ 105°C, Radial Can - SMD; Dielectric Material: Aluminium; Voltage: 50V; Ripple Current (AC): 195mA; Lead Diameter: 650µm; Impedance: 680mΩ; Leakage Current: 16.5µA; Max Operating Temperature: 105°C; Contact Plating: Tin; Packaging: Cut Tape; Width: 8.3mm; Schedule B: 8532220020, 8532220020; Number of Pins: 2; RoHS: Compliant; Mount: PCB, Surface Mount; Diameter: 8mm; Material: Aluminium; Lead Free: Lead Free; Height - Seated (Max): 6.1976mm; Termination: SMD/SMT; ESR (Equivalent Series Resistance): 680mΩ; Voltage Rating (AC): 50V; Lifecycle Status: Production; Height: 6.2mm; Voltage Rating: 50V; Life (Hours): 2000hours; Lead Pitch: 2.2mm; NexarPartId: 5444366; Ripple Current: 195mA; REACH SVHC: No SVHC; Voltage Rating (DC): 50V; Length: 6.2mm; Tolerance: 20%; Min Operating Temperature: -55°C; Case/Package: Radial; Radiation Hardening: No
D3 D4 = CMP-07163-000022-1: DIODE GEN PURP 1KV 1A SMA; Manufacturer: ON Semiconductor; Max Surge Forward Current: 30A; Max Repetitive Reverse Voltage: 1000V; Value: 10pF; Max Junction Temp: +150°C; Peak Reverse Current: 5uA; Standoff Height: 0.05mm; ComponentLink2URL: https://www.onsemi.com/pub/Collateral/RS1M-D.PDF; Footprint Url: https://www.onsemi.com/pub/Collateral/403AE.PDF; Mouser Description: On a Reel of 7500, ON Semi 1000V 1A, Diode, 2-Pin DO-214AC RS1M; Package: 403AE; Manufacturer Part Number: RS1M; Temperature Range Low: -55°C; Device Class L1: Discrete Semiconductors; Automotive: No; Height: 2.5mm; Octopart: https://octopart.com/rs1m-on+semiconductor-84331238; Digikey Description: DIODE GEN PURP 1KV 1A SMA; Temperature Range High: +150°C; Capacitance: 10pF; RoHS: TRUE; Device Class L2: Diodes; ComponentLink2Description: Datasheet; Temperature: -55°C to +150°C; Device Class L3: Rectifier Diodes; Forward Current: 1A; Lead Free: Yes; Category: Diode
D5 = LED_0603_GREEN: LED SMD 0603 GREEN 71-450mcd 130° WATER CLEAR
Q1 = MOSFET_P_CHANNEL: P-Channel 60 V 3A (Ta) 2.2W (Ta) Surface Mount SOT-223-3
Q2 = 2N7002: N-Channel 60 V 300mA (Ta) 350mW (Ta) Surface Mount SOT-23-3 (TO-236)
R12 R20 = RES: as R10 on sheet UCC28180_PFC_Controller
R13 R14 = RES: RES.(1608) 0603 4.7K Ohms 1% 1/10W-S 100PPM
R15 = RES: as R1 on sheet AC_Input_Rectifier
R16 = RES: RES.(1608) 0603 1M Ohms 5% 1/10W 200PPM,
R17 R19 = RES: RES.(1608) 0603 330K Ohms 5% 1/10W-S 100PPM
R18 = RES: RES.(1608) 0603 3.3K Ohms 1% 1/10W AUTOMOTIV
TP2 = TEST_POINT_RND_1MM: Test Point Round 1mm (NO BOM)
Z3 = ZENER-1: DIODE ZENER 500mW 18V ±5% SOD123 SMT

## Sheet Output_CONN.SchDoc
size A4; SheetNumber: 8; SheetTotal: 8
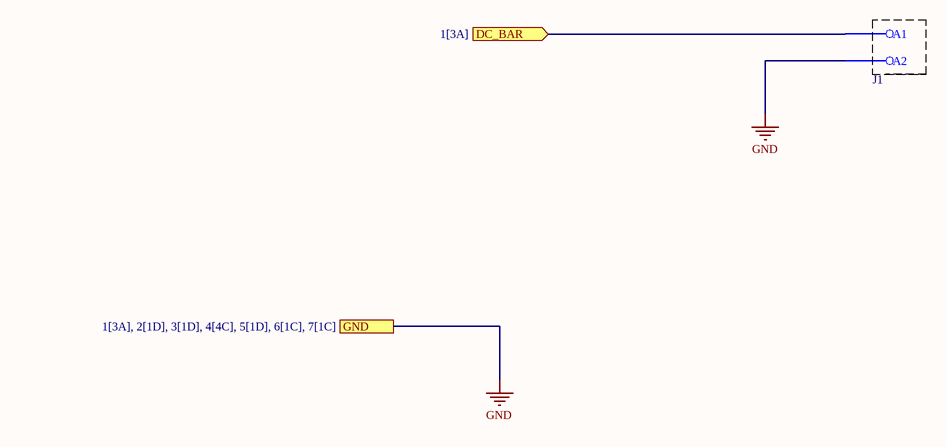
[diagram p6: Output_CONN.SchDoc]

### Parts
J1  DG136HT-10.16-02P-14-00A  [DG136HT-02P]  (value not drawn)

### Ports
DC_BAR (in, see 1[3A]), GND (see 1[3A], 2[1D], 3[1D], 4[4C], 5[1D], 6[1C], 7[1C])

### Nets
GND: J1.2(A2) ; port GND
VBUS: J1.1(A1) ; port DC_BAR

### Library data of the parts
J1 = DG136HT-10.16-02P-14-00A: PCB terminal blocks,Rated current: 65A,Rated voltage （III/2）1000V,Cross section:2.5-16mm²,pitch:10.16mm,connector method:Screw connector with tension sleeve,Color:green,Contact surface :Tin

## Sheet PFC_15V_PwrSRegulator.SchDoc
size A4; SheetNumber: 4; SheetTotal: 8
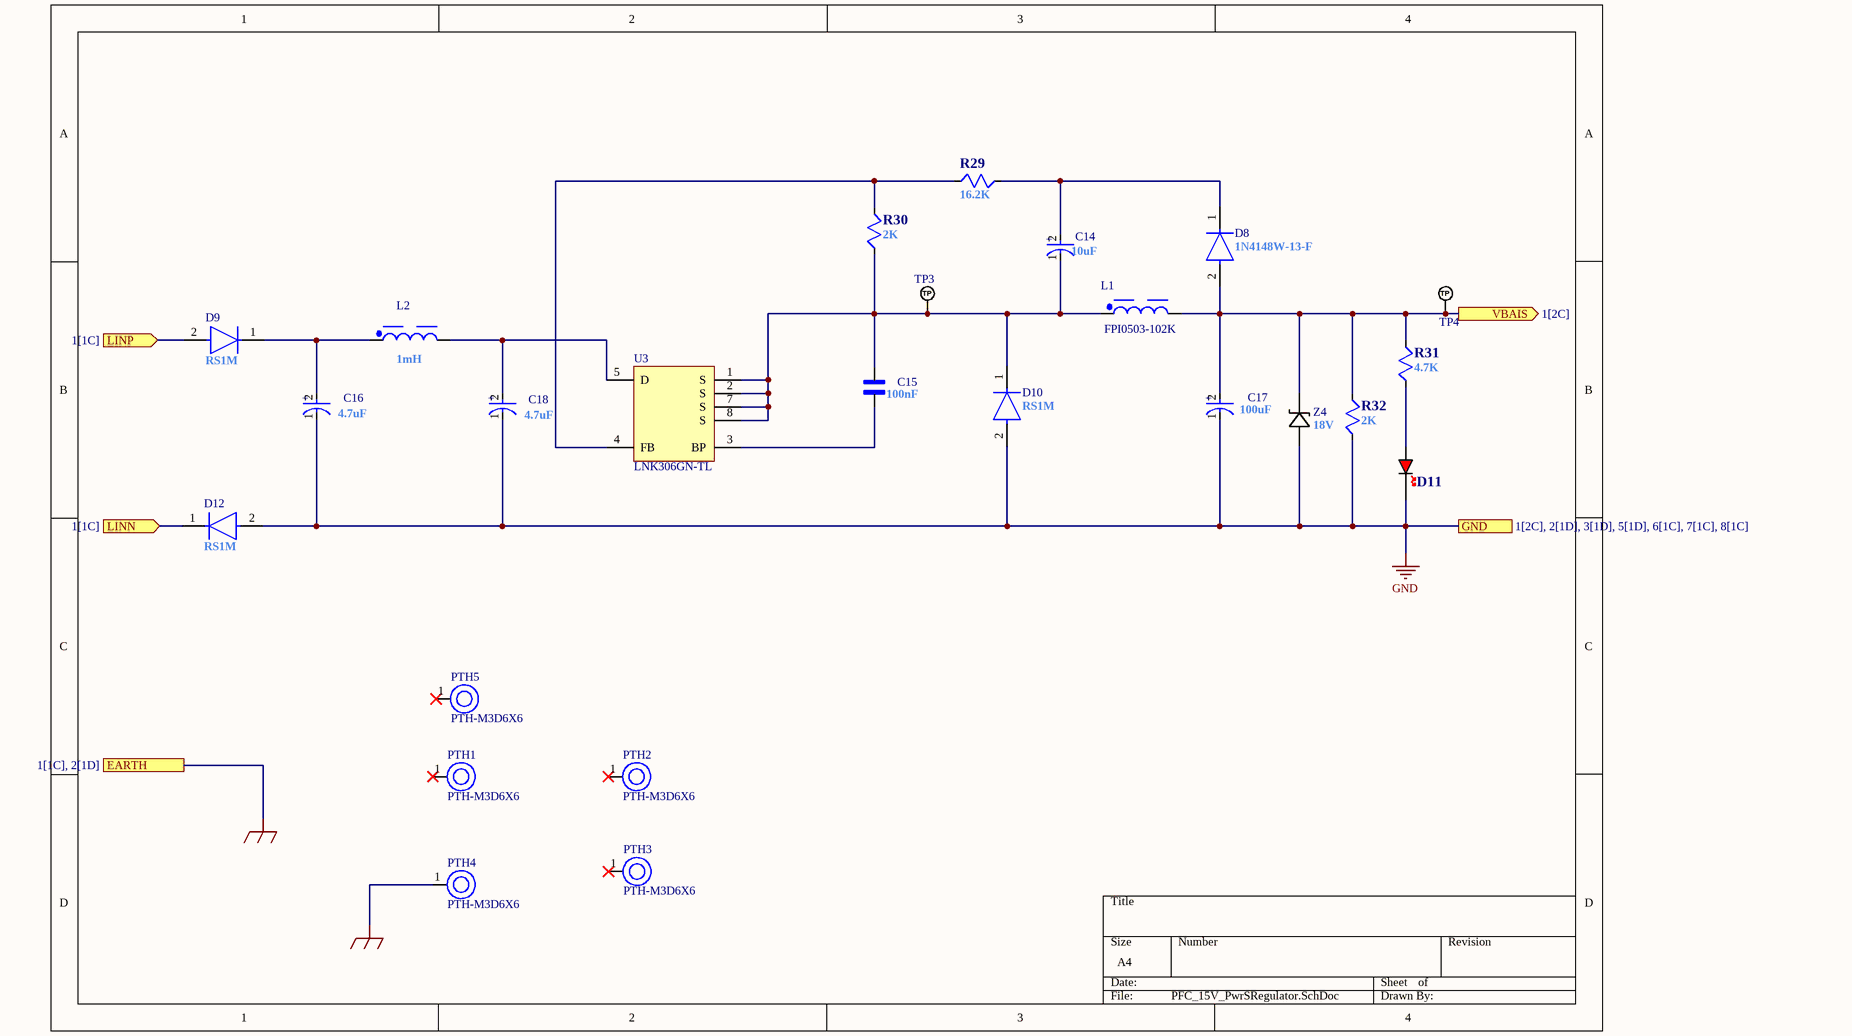
[diagram p7: PFC_15V_PwrSRegulator.SchDoc]

### Parts
C14  Capacitance: 10uF  [FP-FKC-MFG]  (hidden comment: SC1V106M05005VR)
C15  value 100nF  [CAPC3216X140N]  (hidden comment: C1206C104KARECAUTO)
C16  Capacitance: 4.7uF  [FP-RAD-TH-D_10_0_5-L_12_5-MFG]  (hidden comment: PKLH-400V4R7MG125-T/A5.0)
C17  Capacitance: 100uF  [FP-SEV8X10_5-MFG]  (hidden comment: CKL025M101F10PKKKV00A)
C18  Capacitance: 4.7uF  [FP-RAD-TH-D_10_0_5-L_12_5-MFG]  (hidden comment: PKLH-400V4R7MG125-T/A5.0)
D8  1N4148W-13-F  [FP-SOD123-MFG]
D9  RS1M  [FP-403AE-MFG]
D10  RS1M  [FP-403AE-MFG]
D11  19-21/R6C-AP1Q2/4T  [LED_0603_RED]  (value not drawn)
D12  RS1M  [FP-403AE-MFG]
L1  FPI0503-102K  [WE-LQS_6045]
L2  Inductance: 1mH  [WE-PD2_1054]  (hidden comment: FPI0705-102K(W0.15))
PTH1  PTH-M3D6X6  [PH3.2]
PTH2  PTH-M3D6X6  [PH3.2]
PTH3  PTH-M3D6X6  [PH3.2]
PTH4  PTH-M3D6X6  [PH3.2]
PTH5  PTH-M3D6X6  [PH3.2]
R29  value 16.2K  [RESC1608N]  (hidden comment: 0603SAF1622T5E)
R30  value 2K  [RESC1608N]  (hidden comment: HP03W5F2001T5E)
R31  value 4.7K  [RESC1608N]  (hidden comment: 0603SAF4701T5E)
R32  value 2K  [RESC1608N]  (hidden comment: HP03W5F2001T5E)
TP3  TP_NOBOM  [PAD_RND_1MM]  (value not drawn)  (no BOM)
TP4  TP_NOBOM  [PAD_RND_1MM]  (value not drawn)  (no BOM)
U3  LNK306GN-TL  [PI-SMD-8B-7_V]
Z4  Type: 18V  [ZDO_SOD323_DIO-M]  (hidden comment: MMSZ5248BS-7-F)

### Ports
EARTH (see 1[1C], 2[1D]), GND (see 1[2C], 2[1D], 3[1D], 5[1D], 6[1C], 7[1C], 8[1C]), LINN (in, see 1[1C]), LINP (in, see 1[1C]), VBAIS (out, see 1[2C])

### Nets
15V: C17.2(A) D8.2(A) L1.2 R31.1 R32.1 TP4.1(TP) Z4.1 ; port VBAIS
EARTH: PTH4.1 ; port EARTH
GND: C16.1(C) C17.1(C) C18.1(C) D10.2(A) D11.K D12.2(A) R32.2 Z4.2 ; port GND
NetC14_1: C14.1(C) C15.2 D10.1(C) L1.1 R30.2 TP3.1(TP) U3.1(S) U3.2(S) U3.7(S) U3.8(S)
NetC14_2: C14.2(A) D8.1(C) R29.1
NetC15_1: C15.1 U3.3(BP)
NetC16_2: C16.2(A) D9.1(C) L2.1
NetC18_2: C18.2(A) L2.2 U3.5(D)
NetD1_2: D9.2(A) ; port LINP
NetD1_3: D12.1(C) ; port LINN
NetD11_A: D11.A R31.2
NetR29_2: R29.2 R30.1 U3.4(FB)

Not connected (* = marked no-connect by the designer): PTH1 1*; PTH2 1*; PTH3 1*; PTH5 1*

### Notes on the sheet
- (in symbol CMP-05427-000030-1) +
- (in symbol CMP-05427-001671-1) +
- (in symbol CMP-35376-000024-1) +

### Library data of the parts
C14 = CMP-05427-000030-1: CAP.EL.10uF 35V 5x5.3 85C SMD SAMWHA; Impedance: 1.52R; Ripple Current (AC): 32mA; Tolerance: 20%; Ripple Current: 85mA; Life (Hours): 2000Hour; Leakage Current: 3uA; Voltage Rating (DC): 50V; Dielectric Material: Aluminium; Length: 5.8mm; Voltage Rating: 35V; Radiation Hardening: No; Max Operating Temperature: 105°C; REACH SVHC: No SVHC; RoHS Compliant: Yes; Case/Package: Radial; Height: 5.8mm; Voltage: 35V; Diameter: 5mm; Number of Pins: 2; Series: FK; Lead Free: Lead Free; Width: 6.5mm; ESR (Equivalent Series Resistance): 1.52R; Package Quantity: 1000; Construction: Cylindrical; Packaging: Tape and Reel; Height - Seated (Max): 0.228inch; Contact Plating: Tin; Min Operating Temperature: -55°C; Termination: SMD/SMT; Material: Aluminium; Mount: Surface Mount
C15 = C1206C104KARECAUTO: 0.1 ÂµF Â±10% 250V Ceramic Capacitor X7R 1206 (3216 Metric); MF: KEMET; SnapEDA_Link: https://www.snapeda.com/parts/C1206C104KARECAUTO/Kemet/view-part/?ref=snap; Package: 3216 KEMET; MP: C1206C104KARECAUTO; Check_prices: https://www.snapeda.com/parts/C1206C104KARECAUTO/Kemet/view-part/?ref=eda
C16 C18 = CMP-05427-001671-1: CAP.EL.4u7 400V 10X12.5 5MM %20 105C LOW IMP; Dissipation Factor: 0.2%; Tolerance: 20%; Ripple Current (AC): 65mA; Polarity: Polar; Life (Hours): 2000Hour; Lead/Base Style: Straight; Lead Diameter: 0.6mm; Voltage Rating (DC): 350V; Length: 12.5mm; Height - Seated (Max): 0.531inch; Mount: Through Hole; Diameter: 10mm; Case/Package: Radial; Max Operating Temperature: 85°C; Ripple Current: 65mA; Radiation Hardening: No; Lead Pitch: 5mm; Packaging: Bulk; Termination: Radial; Construction: RADIAL; Series: M; REACH SVHC: No SVHC; RoHS Compliant: Yes; Voltage Rating: 350V; Min Operating Temperature: -25°C; Height: 12.5mm; Package Quantity: 200
C17 = CMP-35376-000024-1: CAP.EL.100uF 25V 8x10 105C 5000H AEC-Q200 SMT; Polarity: Polar; Life (Hours): 2000Hour; Tolerance: 20%; Ripple Current: 240mA; Case/Package: Radial; Package Quantity: 1; Voltage Rating: 25V; Min Operating Temperature: -40°C; Lead Pitch: 3.1mm; Height - Seated (Max): 0.413inch; Ratings: AEC-Q200; Lead Free: Lead Free; Construction: Cylindrical; Max Operating Temperature: 85°C; Packaging: Tape and Reel; RoHS Compliant: Yes; Mount: Surface Mount; Radiation Hardening: No; Series: SEV
D8 = CMP-12791-000005-1: DIODE GEN PURP 100V 150MA SOD123; Manufacturer: Diodes Inc.; Capacitance: 2pF; Forward Current: 300mA; Max Junction Temp: +150°C; Value: 2pF; Standoff Height: 0mm; Peak Reverse Current: 1uA; Max Surge Forward Current: 1A; Category: Diode; Height: 1.45mm; ComponentLink2URL: https://upverter.com/datasheet/628e7d6fee5901eee6eef4567d1c3569f2cd3cde.pdf; Lead Free: Yes; ComponentLink2Description: Datasheet; Octopart: https://octopart.com/1n4148w-13-f-diodes+inc.-2359612; Temperature Range High: +150°C; Device Class L2: Diodes; Digikey Description: DIODE GEN PURP 100V 150MA SOD123; Reverse Voltage: 100V; Temperature Range Low: -65°C; Device Class L1: Discrete Semiconductors; Package: SOD123; RoHS: TRUE; Manufacturer Part Number: 1N4148W-13-F; Footprint Url: https://www.diodes.com/assets/Package-Files/SOD123.pdf; Automotive: No; Max Repetitive Reverse Voltage: 100V; Mouser Description: 1N4148W Series 2 A 100 V 400 mW Surface Mount Fast Switching Diode - SOD-123; Temperature: -65°C to +150°C; Device Class L3: Rectifier Diodes
D9 D10 D12 = CMP-07163-000022-1: as D3 on sheet SoftStart_Controll_Circuit; ComponentLink2URL: https://www.onsemi.com/pub/Collateral/RS1M-D.PDF; Footprint Url: https://www.onsemi.com/pub/Collateral/403AE.PDF; Mouser Description: On a Reel of 7500, ON Semi 1000V 1A, Diode, 2-Pin DO-214AC RS1M; Package: 403AE; Manufacturer Part Number: RS1M; Temperature Range Low: -55°C; Device Class L1: Discrete Semiconductors; Automotive: No; Height: 2.5mm; Octopart: https://octopart.com/rs1m-on+semiconductor-84331238; Digikey Description: DIODE GEN PURP 1KV 1A SMA; Temperature Range High: +150°C; Capacitance: 10pF; RoHS: TRUE; Device Class L2: Diodes; ComponentLink2Description: Datasheet; Temperature: -55°C to +150°C; Device Class L3: Rectifier Diodes; Forward Current: 1A; Lead Free: Yes; Category: Diode
D11 = LED_0603_RED: as D15 on sheet PFC_PWR_BOOST_CNV
L1 = CMP-03913-61645236-2: POWER INDUCTOR General Purpose Inductor, 1000uH, 10%, 1 Element, SMD, 2424; Inductance Tolerance: 20%; Test Frequency: 100kHz; Saturation Current: 365mA; Inductance: 1mH; Self Resonant Frequency: 1.86MHz; Current Rating: 300mA; DC Resistance (DCR): 4.783Ω; Shielding: Shielded; Length: 6mm; Min Operating Temperature: -40°C; Height: 4.5mm; Ambient Temperature Range Low: -40°C; Composition: Wirewound; RoHS: Compliant; Ambient Temperature Range High: 85°C; Height - Seated (Max): 4.4958mm; Mount: Surface Mount; Max Operating Temperature: 125°C; Packaging: Tape & Reel (TR); Case/Package: Nonstandard; Tolerance: 20%; Width: 6mm
L2 = CMP-0227-00499-2: INDUCTOR POWER 1mH 7.8X7.0X5.0MM SMD; Test Frequency: 10kHz; DC Resistance (DCR): 3.3 Ohm; RMS Current (Irms): 380mA; Tolerance: 10%; Inductance Tolerance: 20%; Shielding: Unshielded; Core Material: Ferrite; Packaging: Digi-Reel®; Composition: Wirewound; Lead Free: Lead Free; Min Operating Temperature: -40°C; Saturation Current: N/A; RoHS: Compliant; Height - Seated (Max): 5.8928mm; Ambient Temperature Range Low: -40°C; Case/Package: Nonstandard; Termination: SMD/SMT; REACH SVHC: Unknown; Width: 10mm; Ambient Temperature Range High: 85°C; Length: 9mm; Mount: Surface Mount; Height: 5.4mm; Max Operating Temperature: 125°C
PTH1-PTH5 = PTH_S1
R29 = RES: RES.(1608) 0603 16.2K Ohms 1% 1/10W-S 100PPM
R30 R32 = RES: RES.(1608) 0603 2K Ohms 1% 1/5W
R31 = RES: as R13 on sheet SoftStart_Controll_Circuit
TP3 TP4 = TEST_POINT_RND_1MM: Test Point Round 1mm (NO BOM)
U3 = CMP-2000-06569-1: Lowest Component Count, Energy-Efficient Off-Line Switcher IC, 85 to 265 V, 220 uA, -40 to 150 degC, 7-Pin SMD, RoHS, Tube; Manufacturer: Power Integrations; Output type: Adjustable; Function: Regulator; Topology: Flyback; Input voltage: 85...265VAC; Mounting Technology: SurfaceMount; Datasheet Version: Rev. J, 06/2013; Datasheet URL: http://www.mouser.com/ds/2/328/lnk302_304-306-179954.pdf; Package Reference: SMD-8B-7; Manufacturer URL: https://www.power.com/; Package: SMD-8B(7-PIN); Package Description: 7-Pin Surface Mount Device, Body 9.575 x 6.35 mm
Z4 = MMSZ5248BS-7-F: Zener Diode 18 V 200 mW ±5% Surface Mount SOD-323; Manufacturer_Name: Diodes Inc; Copyright: Copyright (C) 2026 Ultra Librarian. All rights reserved.; Manufacturer_Part_Number: MMSZ5248BS-7-F

## Nets that join several sheets
15V: AC_Input_Rectifier (R8.1), UCC27444_GateDrivers (5 pins), UCC28180_PFC_Controller (C4.2 C5.2 U1.7 Z1.2), SoftStart_Controll_Circuit (6 pins), PFC_15V_PwrSRegulator (7 pins)
EARTH: AC_Input_Rectifier (J2.3), PFC_15V_PwrSRegulator (PTH4.1)
GND: AC_Input_Rectifier (5 pins), PFC_PWR_BOOST_CNV (5 pins), UCC27444_GateDrivers (7 pins), UCC28180_PFC_Controller (10 pins), SoftStart_Controll_Circuit (6 pins), Output_CONN (J1.2), PFC_15V_PwrSRegulator (8 pins)
VBUS: PFC_PWR_BOOST_CNV (6 pins), Output_CONN (J1.1)
ISENSE: AC_Input_Rectifier (C2.2 R6.2), UCC28180_PFC_Controller (U1.3 Z2.2)
NetC1_2: AC_Input_Rectifier (C1.2 D1.1 R1.1), PFC_PWR_BOOST_CNV (D13.2 L3.1 TP5.1)
NetD1_2: AC_Input_Rectifier (D1.2 F1.2 R3.2), SoftStart_Controll_Circuit (D3.2), PFC_15V_PwrSRegulator (D9.2)
NetD1_3: AC_Input_Rectifier (D1.3 K1.3 R5.2), SoftStart_Controll_Circuit (D4.2), PFC_15V_PwrSRegulator (D12.1)
NetD6_1: PFC_PWR_BOOST_CNV (Q5.1), UCC27444_GateDrivers (D6.1 Q3.2)
NetR9_2: UCC27444_GateDrivers (R28.2 U2.2), UCC28180_PFC_Controller (R9.2 TP1.1)
VSENSE: PFC_PWR_BOOST_CNV (R35.2 R36.1), UCC28180_PFC_Controller (C7.2 U1.6)